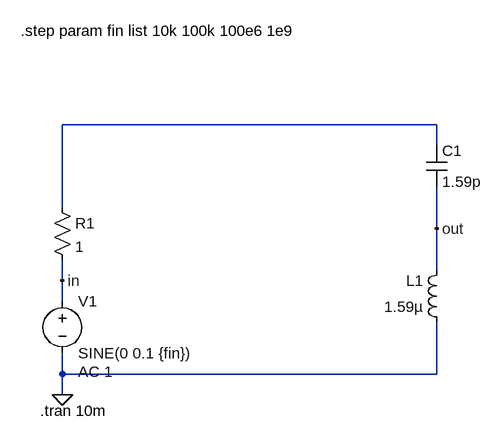
[diagram p0: schematic Draft4.asc]
Draft4.asc, the LTspice schematic file:
Version 4
SHEET 1 880 680
WIRE 640 16 64 16
WIRE 640 48 640 16
WIRE 64 144 64 16
WIRE 640 176 640 112
WIRE 640 240 640 176
WIRE 64 256 64 224
WIRE 64 288 64 256
WIRE 64 400 64 368
WIRE 640 400 640 320
WIRE 640 400 64 400
WIRE 64 432 64 400
FLAG 64 432 0
FLAG 640 176 out
FLAG 64 256 in
SYMBOL voltage 64 272 R0
WINDOW 123 24 124 Left 2
WINDOW 39 0 0 Left 0
SYMATTR InstName V1
SYMATTR Value SINE(0 0.1 {fin})
SYMATTR Value2 AC 1
SYMBOL res 48 128 R0
SYMATTR InstName R1
SYMATTR Value 1
SYMBOL ind 656 336 R180
WINDOW 0 36 80 Left 2
WINDOW 3 36 40 Left 2
SYMATTR InstName L1
SYMATTR Value 1.59µ
SYMBOL cap 624 48 R0
SYMATTR InstName C1
SYMATTR Value 1.59p
TEXT 30 456 Left 2 !.tran 10m
TEXT 0 -128 Left 2 !.step param fin list 10k 100k 100e6 1e9

The netlist it stands for:
* Draft4.asc
V1 in 0 SINE(0 0.1 {fin}) AC 1
R1 N001 in 1
L1 0 out 1.59µ
C1 N001 out 1.59p
.tran 10m
.step param fin list 10k 100k 100e6 1e9
.backanno
.end